# EAGLE design MotorController (EAGLE 9.6.2)
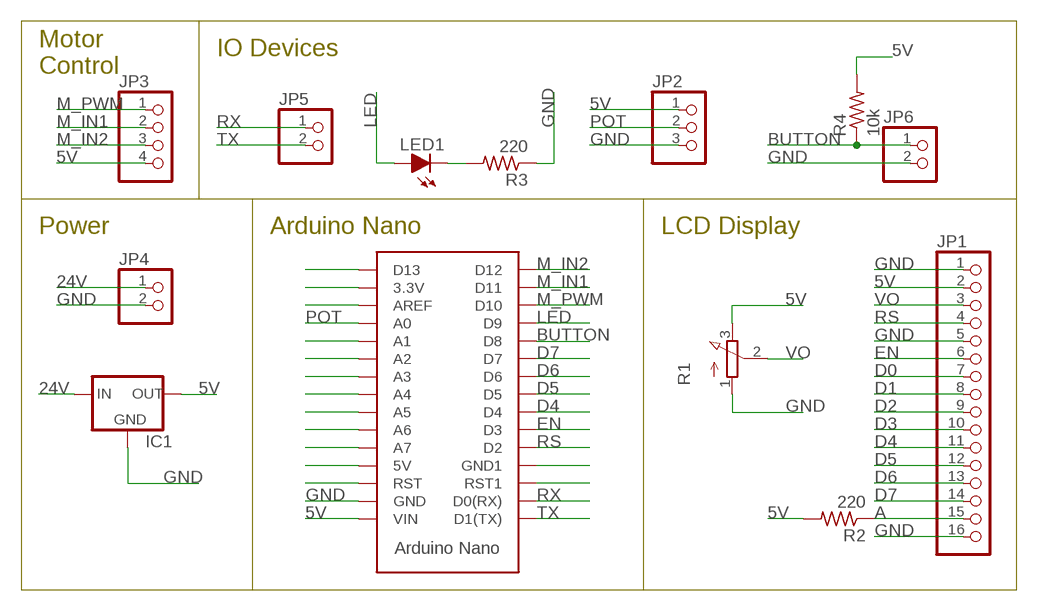
[diagram p0: schematic, sheet 1]

## Parts
IC1  REG_5V_L7805_HOR  [TO-220-H]
JP1  PINHD-1X16  [1X16]
JP2  PINHD-1X3  [1X03]
JP3  PINHD-1X4  [1X04]
JP4  PINHD-1X2  [1X02]
JP5  PINHD-1X2  [1X02]
JP6  PINHD-1X2  [1X02]
LED1  LED-5MM  [LED-5MM]
R1  POTENTIOMETER  [3RP/1610N]
R2  220  RES_AXIAL1/4W-0.4  [1/4W-0.4]
R3  220  RES_AXIAL1/4W-0.4  [1/4W-0.4]
R4  10k  RES_AXIAL1/4W-0.4  [1/4W-0.4]
U$1  ARDUINO_NANO  [ARDUINO_NANO]

## Nets
5V: IC1.3(OUT) JP1.2 JP2.1 JP3.4 R1.3(E) R2.2 R4.2 U$1.VIN
24V: IC1.1(IN) JP4.1
A: JP1.15 R2.1
BUTTON: JP6.1 R4.1 U$1.D8
D0: JP1.7
D1: JP1.8
D2: JP1.9
D3: JP1.10
D4: JP1.11 U$1.D4
D5: JP1.12 U$1.D5
D6: JP1.13 U$1.D6
D7: JP1.14 U$1.D7
EN: JP1.6 U$1.D3
GND: IC1.2(GND) JP1.1 JP1.5 JP1.16 JP2.3 JP4.2 JP6.2 R1.1(A) R3.1 U$1.GND
LED: LED1.A U$1.D9
M_IN1: JP3.2 U$1.D11
M_IN2: JP3.3 U$1.D12
M_PWM: JP3.1 U$1.D10
N$1: U$1.D13
N$2: U$1.3.3V
N$3: U$1.AREF
N$5: U$1.A1
N$6: U$1.A2
N$7: U$1.A3
N$8: U$1.A4
N$9: U$1.A5
N$10: U$1.A6
N$11: U$1.A7
N$12: U$1.5V
N$13: U$1.RST
N$27: U$1.GND1
N$28: U$1.RST1
N$59: LED1.K(C) R3.2
POT: JP2.2 U$1.A0
RS: JP1.4 U$1.D2
RX: JP5.1 U$1.D0(RX)
TX: JP5.2 U$1.D1(TX)
VO: JP1.3 R1.2(S)

## Notes on the sheet
- IO Devices
- Motor
  Control
- Power | Arduino Nano | LCD Display

## Library data of the parts
IC1 = GTOR - Active Components:REG_5V_L7805: Voltage Regulator Switching 5v regulator Datasheet <http://power.murata.com/data/power/oki-78sr.pdf> Standard 7805 5V regulator. IGO (Input Ground Output). Spark Fun Electronics SKU : COM-00107 Datasheet <http://www.mouser.com/ds/2/308/MC7800-D-94905.pdf>
JP1 = GTOR - Connectors:PINHD-1X16: PIN HEADER
JP2 = GTOR - Connectors:PINHD-1X3: PIN HEADER
JP3 = GTOR - Connectors:PINHD-1X4: PIN HEADER
JP4-JP6 = GTOR - Connectors:PINHD-1X2: PIN HEADER
LED1 = GTOR - Passive Components:LED: Light Emitting Diode (LED) Source: Dangerous Prototypes Eagle Library <https://github.com/DangerousPrototypes/Eagle_Part_Library>
R1 = GTOR - Passive Components:POTENTIOMETER: 16mm Potentiometer one level Source: http://www.alphapotentiometers.net/html/16mm_pot_2.html
R2-R4 = GTOR - Passive Components:RES_AXIAL: RESISTOR, American symbol; SPICEPREFIX: R
U$1 = GTOR - Microcontroller:ARDUINO_NANO: Arduino Nano Device Specifications <https://www.arduino.cc/en/Main/ArduinoBoardNano> Pinout Diagram <http://pighixxx.com/nanopdf.pdf>

## Board
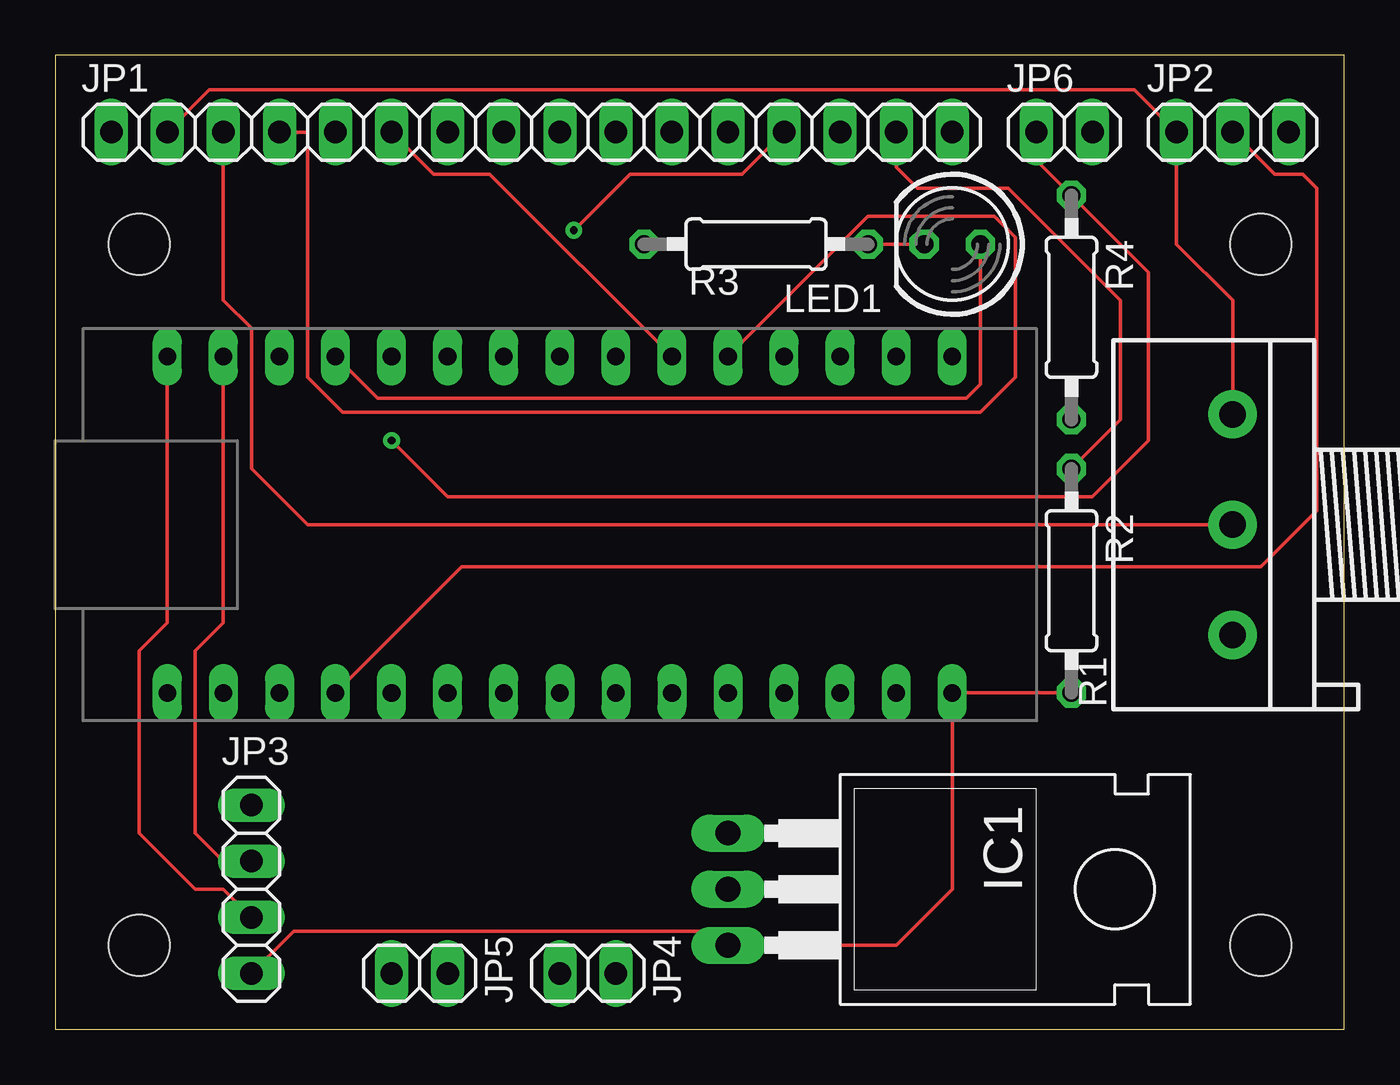
[diagram p1: board, top side]
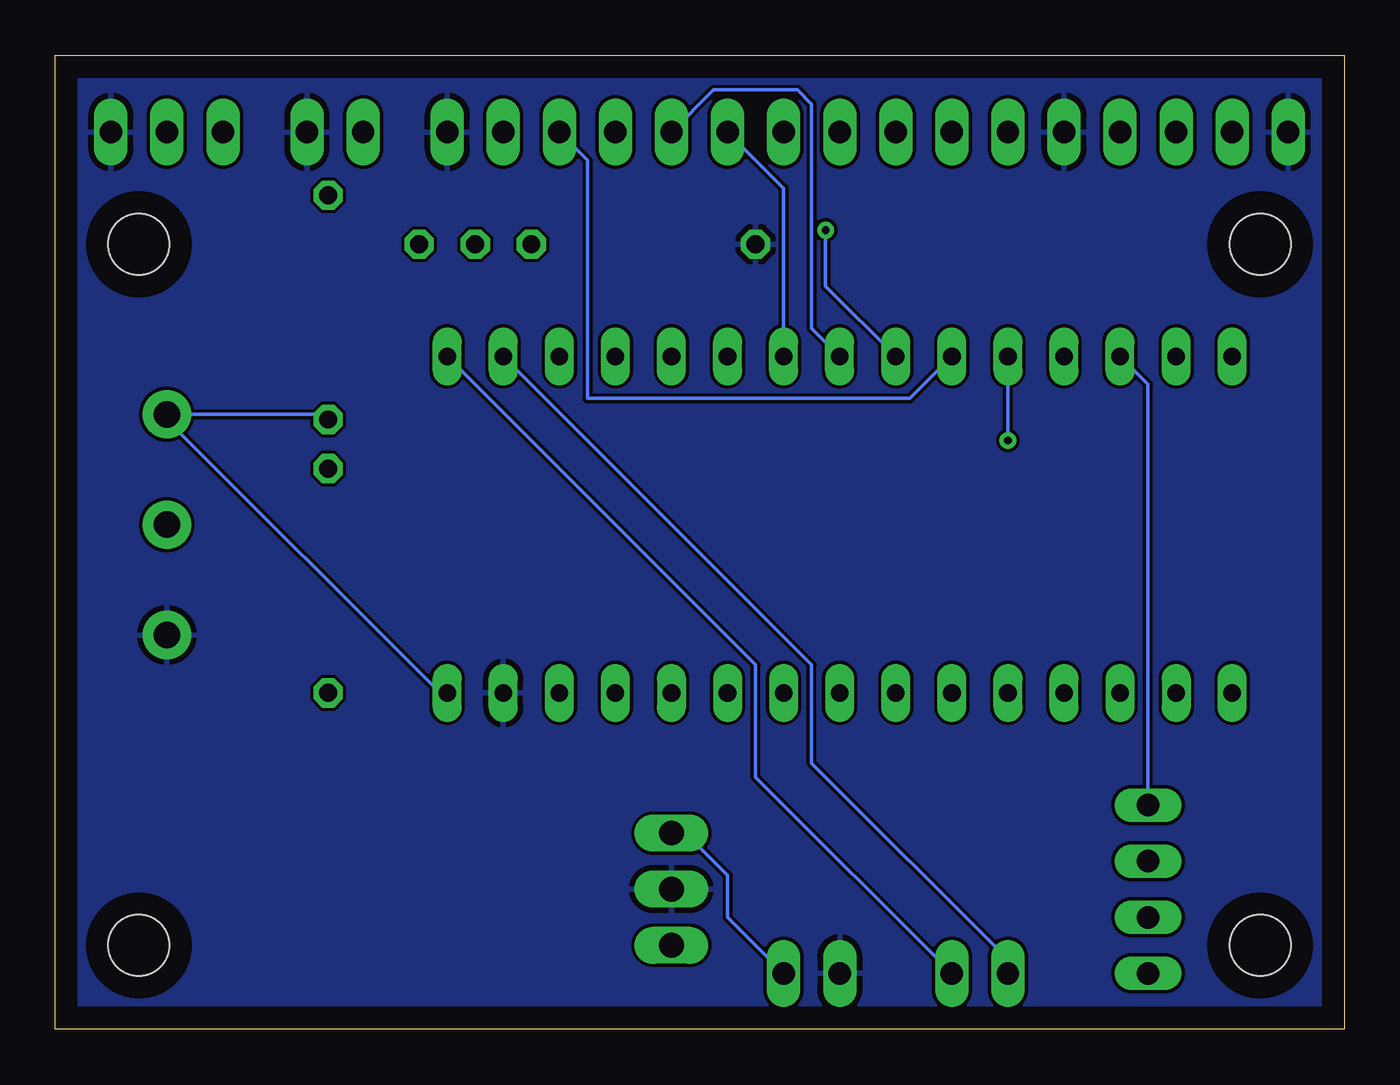
[diagram p2: board, bottom side, seen from below]

Size 58.4 x 44.12 mm. Coordinates in mm from the lower left corner, seen from the top.
Outline: 0,0 58.4,0 58.4,44.12 0,44.12 0,0
Copper layers (1*16): Top 0.035mm / dielectric 1.5mm / Bottom 0.035mm
Design rules "default": minimum track width 6mil, minimum drill 0.35mm, track to track 6mil, track to pad 6mil, pad to pad 6mil, via to via 6mil, smd to smd 6mil, copper to edge 40mil, drill to drill 6mil, minimum pad ring 10mil, minimum via ring 8mil, stop-mask expansion 4mil, vias tented up to drill 0mil, thermal gap 10mil
Holes 2.75 mm at 3.81,3.81 54.61,3.81 3.81,35.56 54.61,35.56

### Footprints (pad centres in the part's own frame; a part is rotated, then mirrored left to right if it is on the bottom)
TO-220-H = drill 1.118 long: 1 -2.54,-6.35; 2 0,-6.35; 3 2.54,-6.35
1X16 = drill 1.016 long: 1 -19.05,0; 2 -16.51,0; 3 -13.97,0; 4 -11.43,0; 5 -8.89,0; 6 -6.35,0; 7 -3.81,0; 8 -1.27,0; 9 1.27,0; 10 3.81,0; 11 6.35,0; 12 8.89,0; 13 11.43,0; 14 13.97,0; 15 16.51,0; 16 19.05,0
1X03 = drill 1.016 long: 1 -2.54,0; 2 0,0; 3 2.54,0
1X04 = drill 1.016 long: 1 -3.81,0; 2 -1.27,0; 3 1.27,0; 4 3.81,0
1X02 = drill 1.016 long: 1 -1.27,0; 2 1.27,0
LED-5MM = drill 0.813 octagon: A -1.27,0; K 1.27,0
3RP/1610N = drill 1.2 pad 2.184: 1 -5,0; 2 0,0; 3 5,0
1/4W-0.4 = drill 0.813 octagon: 1 -5.08,0; 2 5.08,0
ARDUINO_NANO = drill 0.8 long: 3.3V 1.27,36.83; 5V 1.27,11.43; A0 1.27,31.75; A1 1.27,29.21; A2 1.27,26.67; A3 1.27,24.13; A4 1.27,21.59; A5 1.27,19.05; A6 1.27,16.51; A7 1.27,13.97; AREF 1.27,34.29; D0(RX) 16.51,6.35; D1(TX) 16.51,3.81; D2 16.51,13.97; D3 16.51,16.51; D4 16.51,19.05; D5 16.51,21.59; D6 16.51,24.13; D7 16.51,26.67; D8 16.51,29.21; D9 16.51,31.75; D10 16.51,34.29; D11 16.51,36.83; D12 16.51,39.37; D13 1.27,39.37; GND 1.27,6.35; GND1 16.51,11.43; RST 1.27,8.89; RST1 16.51,8.89; VIN 1.27,3.81

### Placement (x,y rotation side)
IC1  36.83,6.35 270 top
JP1  21.59,40.64 0 top
JP2  53.34,40.64 0 top
JP3  8.89,6.35 270 top
JP4  24.13,2.54 180 top
JP5  16.51,2.54 0 top
JP6  45.72,40.64 0 top
LED1  40.64,35.56 180 top
R1  53.34,22.86 90 top
R2  46.04,20.32 270 top
R3  31.75,35.56 0 top
R4  46.04,32.7 270 top
U$1  44.45,13.97 90 top

### Tracks (layer width: path | path; a pad name or v marks a point on that pad's centre or on a via)
5V
  Top 0.152: JP3.4 10.79,4.45 29.84,4.45 IC1.3 38.1,3.81 40.64,6.35 U$1.VIN R2.2 | JP1.2 6.99,42.55 48.9,42.55 JP2.1 50.8,35.56 53.34,33.02 R1.3
  Bottom 0.152: U$1.VIN 40.96,15.24 53.34,27.62 R1.3 46.27,27.86 R4.2
24V
  Bottom 0.152: JP4.1 27.94,5.08 27.94,6.99 29.84,8.89 IC1.1
A
  Top 0.152: JP1.15 38.1,39.05 39.05,38.1 43.18,38.1 46.99,34.29 48.26,33.02 48.26,27.62 R2.1
BUTTON  (via drill 0.35)
  Top 0.152: JP6.1 44.45,39.37 R4.1 49.53,34.29 49.53,26.67 46.99,24.13 17.78,24.13 v15.24,26.67
  Bottom 0.152: v15.24,26.67 U$1.D8
D4
  Bottom 0.152: JP1.11 25.4,38.1 U$1.D4
D5
  Bottom 0.152: U$1.D5 24.13,31.75 24.13,41.91 24.77,42.55 28.57,42.55 JP1.12
D6  (via drill 0.35)
  Top 0.152: v23.5,36.2 26.04,38.73 31.11,38.73 JP1.13
  Bottom 0.152: U$1.D6 23.5,33.66 v23.5,36.2
D7
  Bottom 0.152: U$1.D7 19.68,28.57 34.29,28.57 34.29,39.37 JP1.14
EN
  Top 0.152: U$1.D3 19.68,38.73 17.14,38.73 JP1.6
GND
  pour Bottom: 0,44.45 0,0 58.42,0 58.42,44.45
LED
  Top 0.152: U$1.D9 14.61,28.57 41.27,28.57 41.91,29.21 LED1.A
M_IN1
  Top 0.152: U$1.D11 7.62,18.41 6.35,17.14 6.35,8.89 7.62,7.62 JP3.2
M_IN2
  Top 0.152: U$1.D12 5.08,18.41 3.81,17.14 3.81,8.89 6.35,6.35 7.62,6.35 JP3.3
M_PWM
  Bottom 0.152: U$1.D10 8.89,29.21 JP3.1
N$59
  Top 0.152: LED1.K R3.2
POT
  Top 0.152: U$1.A0 18.41,20.95 54.61,20.95 57.15,23.5 57.15,38.1 56.52,38.73 55.24,38.73 JP2.2
RS
  Top 0.152: U$1.D2 36.83,36.83 42.55,36.83 43.5,35.88 43.5,29.53 41.91,27.94 13.02,27.94 11.43,29.53 11.43,40.64 JP1.4
RX
  Bottom 0.152: U$1.D0(RX) 24.13,16.51 24.13,12.06 15.24,3.17 JP5.1
TX
  Bottom 0.152: U$1.D1(TX) 26.67,16.51 26.67,11.43 JP5.2
VO
  Top 0.152: JP1.3 7.62,33.02 8.89,31.75 8.89,25.4 11.43,22.86 R1.2

### Text on the board
tDocu: 5V | VO | NC | NC | NC | NC | D4 | D5 | D6 | D7 | A | C | 5V | GND | GND | GND | SIG | GND | RS (D2) | EN (D3) | BUTTON | PWM (EN) | IN1 | IN2 | RX | TX | GND | 24V | 5V